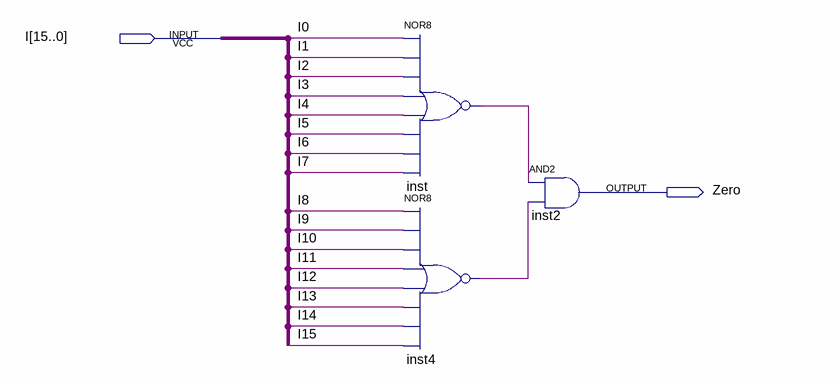
[diagram p0: schematic sheet]
// Quartus schematic Zero_check.bdf as structural Verilog: 3 symbols, 2 pins
module Zero_check (
  input  [15:0] I,
  output Zero
);

  wire inst4_out, inst_out;

  nor inst (inst_out, I[0], I[1], I[2], I[3], I[4], I[5], I[6], I[7]);
  nor inst4 (inst4_out, I[8], I[9], I[10], I[11], I[12], I[13], I[14], I[15]);
  and inst2 (Zero, inst_out, inst4_out);
endmodule
